# Altium schematic sheet Extension.SchDoc
size A3; PageSetup: Record=PageOptions|CenterHorizontal=True|CenterVertical=True|PrintScale=0.73|XCorrection=1.00|YCorrection=1.00|PrintKind=0|BorderSize=5000000|LeftOffset=0|BottomOffset=0|Orientation=2|PaperLength=1000|PaperWidth=1000|Scale=100|PaperSource=7|PrintQuality=-4|MediaType=1|DitherType=10|PaperKind=A4|PrintScaleMode=1; Date: 27.05.2014; DrawnBy: luths8; Organization: BFH; Address1: Bern University of Applied Sciences; Address2: Engineering and Information Technology; Address3: Jlcoweg 1; Address4: CH-3400 Burgdorf; DocumentNumber: 15; Revision: 1.0; SheetNumber: 18; SheetTotal: 19; CurrentDate: 27.05.2014
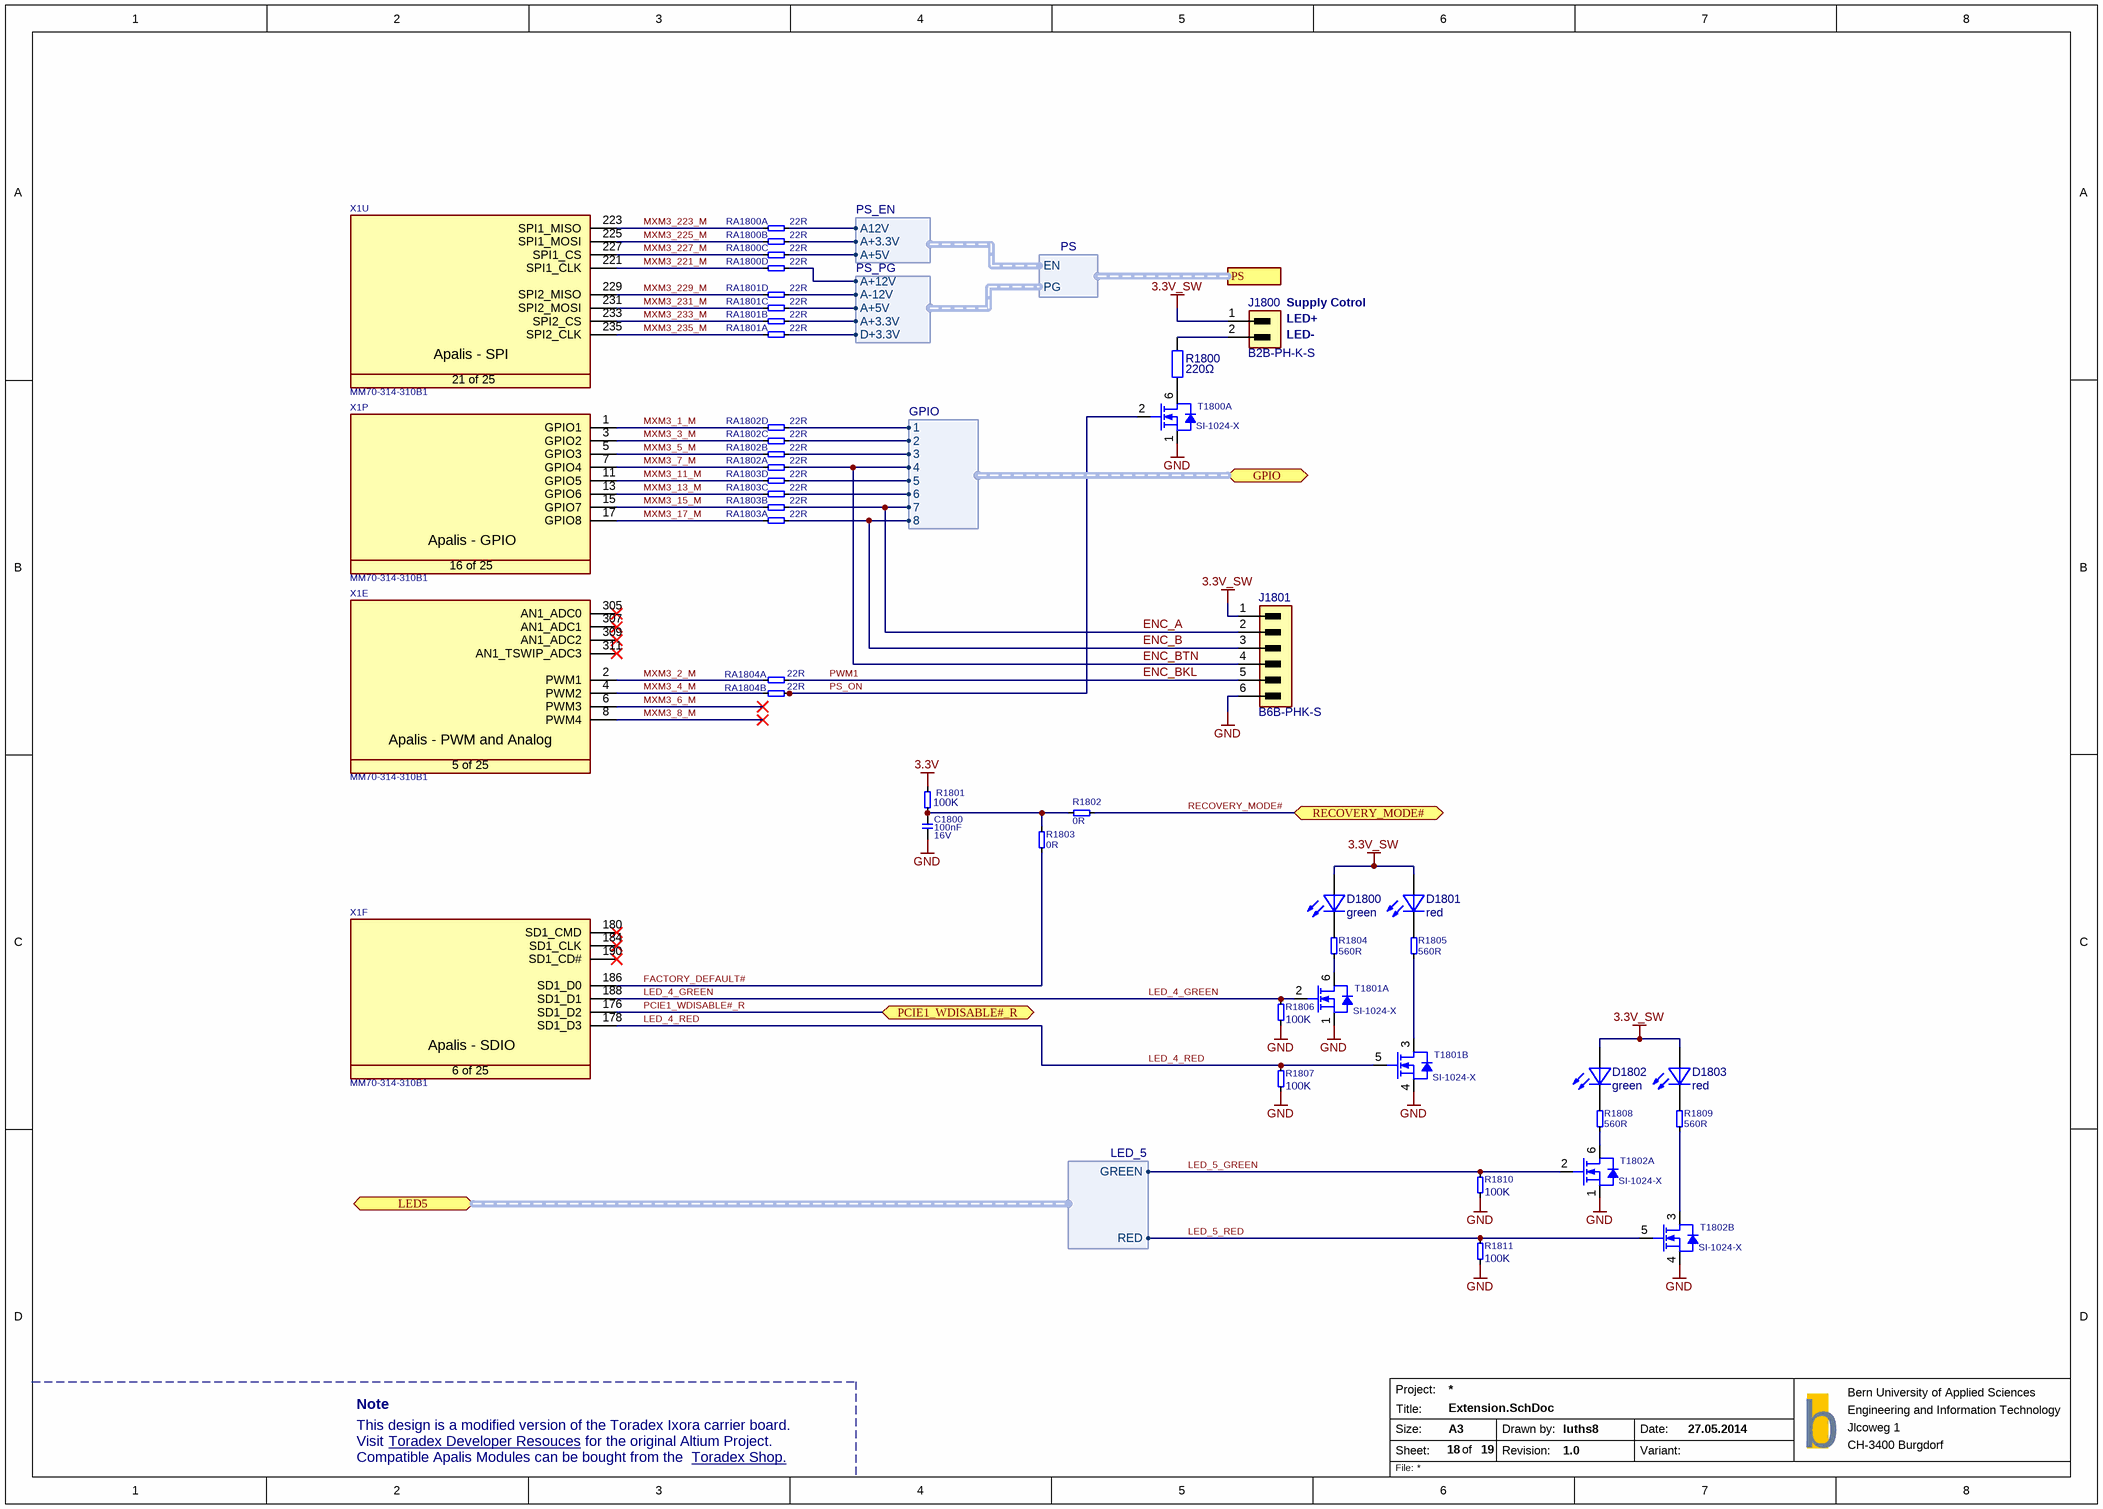
[diagram p0: Extension.SchDoc]

## Parts
C1800  Rating: 16V  [SMD0603CAP]  (hidden comment: 100nF)
D1800  green  [LED]
D1801  red  [LED]
D1802  green  [LED]
D1803  red  [LED]
J1800  B2B-PH-K-S  [B2B-PH-K-S]
J1801  B6B-PHK-S  [B6B-PH-K-S]
R1800  220Ω  [SMD0603RES]
R1801  100K  [SMD0603RES]
R1802  0R  [SMD0603RES]
R1803  0R  [SMD0603RES]
R1804  560R  [SMD0603RES]
R1805  560R  [SMD0603RES]
R1806  100K  [SMD0603RES]
R1807  100K  [SMD0603RES]
R1808  560R  [SMD0603RES]
R1809  560R  [SMD0603RES]
R1810  100K  [SMD0603RES]
R1811  100K  [SMD0603RES]
RA1800  22R  [T_Resistor_Array_X4]  (parts A,B,C,D of 4)
RA1801  22R  [T_Resistor_Array_X4]  (parts A,B,C,D of 4)
RA1802  22R  [T_Resistor_Array_X4]  (parts A,B,C,D of 4)
RA1803  22R  [T_Resistor_Array_X4]  (parts A,B,C,D of 4)
RA1804  22R  [T_Resistor_Array_X4]  (parts A,B of 4)
T1800  Manufacturer Part No.: SI-1024-X  [SOTFL50P160X60-6N]  (hidden comment: T-Vishay-SI-1024X-N)  (part A of 2)
T1801  Manufacturer Part No.: SI-1024-X  [SOTFL50P160X60-6N]  (hidden comment: T-Vishay-SI-1024X-N)  (parts A,B of 2)
T1802  Manufacturer Part No.: SI-1024-X  [SOTFL50P160X60-6N]  (hidden comment: T-Vishay-SI-1024X-N)  (parts A,B of 2)
X1  Manufacturer Part No.: MM70-314-310B1  [T_JAE_MM70-314-310B1]  (hidden comment: CON-JAE-MM70-314-310B1-314-0.5mm)  (parts E,F,P,U of 25)

## Ports
GPIO (bidir, harness GPIO, see 11, 12, 4), LED5 (bidir, harness LED_5, see 8), PCIE1_WDISABLE#_R (bidir, see 18), PS (harness PS), RECOVERY_MODE# (bidir, see 11)

## Harnesses
LED_5: GREEN, RED
PS: EN, PG
GPIO: 1, 2, 3, 4, 5, 6, 7, 8
PS_EN: A12V, A+3.3V, A+5V
PS_PG: A+12V, A-12V, A+3.3V, A+5V, D+3.3V

## Nets
3.3V: R1801.1
3.3V_SW: D1800.A D1801.A D1802.A D1803.A J1800.1 J1801.1
GND: C1800.1 J1801.6 R1806.2 R1807.2 R1810.2 R1811.2 T1800.1(S) T1801.1(S) T1801.4(S) T1802.1(S) T1802.4(S)
ENC_A: J1801.2 RA1803.6 ; port GPIO.7
ENC_B: J1801.3 RA1803.5 ; port GPIO.8
ENC_BKL: J1801.5 RA1804.1  [also labelled PWM1]
ENC_BTN: J1801.4 RA1802.5 ; port GPIO.4
FACTORY_DEFAULT#: R1803.1 X1.186(SD1_D0)
LED_4_GREEN: R1806.1 T1801.2(G) X1.188(SD1_D1)
LED_4_RED: R1807.1 T1801.5(G) X1.178(SD1_D3)
LED_5_GREEN: R1810.1 T1802.2(G) ; port LED5.GREEN
LED_5_RED: R1811.1 T1802.5(G) ; port LED5.RED
MXM3_1_M: RA1802.4 X1.1(GPIO1)
MXM3_2_M: RA1804.5 X1.2(PWM1)
MXM3_3_M: RA1802.3 X1.3(GPIO2)
MXM3_4_M: RA1804.6 X1.4(PWM2)
MXM3_5_M: RA1802.2 X1.5(GPIO3)
MXM3_6_M: X1.6(PWM3)
MXM3_7_M: RA1802.1 X1.7(GPIO4)
MXM3_8_M: X1.8(PWM4)
MXM3_11_M: RA1803.4 X1.11(GPIO5)
MXM3_13_M: RA1803.3 X1.13(GPIO6)
MXM3_15_M: RA1803.2 X1.15(GPIO7)
MXM3_17_M: RA1803.1 X1.17(GPIO8)
MXM3_221_M: RA1800.4 X1.221(SPI1_CLK)
MXM3_223_M: RA1800.1 X1.223(SPI1_MISO)
MXM3_225_M: RA1800.2 X1.225(SPI1_MOSI)
MXM3_227_M: RA1800.3 X1.227(SPI1_CS)
MXM3_229_M: RA1801.4 X1.229(SPI2_MISO)
MXM3_231_M: RA1801.3 X1.231(SPI2_MOSI)
MXM3_233_M: RA1801.2 X1.233(SPI2_CS)
MXM3_235_M: RA1801.1 X1.235(SPI2_CLK)
PCIE1_WDISABLE#_R: X1.176(SD1_D2) ; port PCIE1_WDISABLE#_R
PS_ON: RA1804.2 T1800.2(G)
RECOVERY_MODE#: R1802.2 ; port RECOVERY_MODE#
NetC1800_2: C1800.2 R1801.2 R1802.1 R1803.2
NetD1800_C: D1800.C R1804.2
NetD1801_C: D1801.C R1805.2
NetD1802_C: D1802.C R1808.1
NetD1803_C: D1803.C R1809.1
NetJ1800_2: J1800.2 R1800.2
NetR1800_1: R1800.1 T1800.6(D)
NetR1804_1: R1804.1 T1801.6(D)
NetR1805_1: R1805.1 T1801.3(D)
NetR1808_2: R1808.2 T1802.6(D)
NetR1809_2: R1809.2 T1802.3(D)
NetRA1800_5: RA1800.5 ; harness PS_EN.A12V
NetRA1800_6: RA1800.6 ; harness PS_EN.A+3.3V
NetRA1800_7: RA1800.7 ; harness PS_EN.A+5V
NetRA1800_8: RA1800.8 ; harness PS_PG.A+12V
NetRA1801_5: RA1801.5 ; harness PS_PG.D+3.3V
NetRA1801_6: RA1801.6 ; harness PS_PG.A+3.3V
NetRA1801_7: RA1801.7 ; harness PS_PG.A+5V
NetRA1801_8: RA1801.8 ; harness PS_PG.A-12V
NetRA1802_6: RA1802.6 ; port GPIO.3
NetRA1802_7: RA1802.7 ; port GPIO.2
NetRA1802_8: RA1802.8 ; port GPIO.1
NetRA1803_7: RA1803.7 ; port GPIO.6
NetRA1803_8: RA1803.8 ; port GPIO.5

Not connected (* = marked no-connect by the designer): X1 180(SD1_CMD)* 184(SD1_CLK)* 190(SD1_CD#)* 305(AN1_ADC0)* 307(AN1_ADC1)* 309(AN1_ADC2)* 311(AN1_TSWIP_ADC3)*

## Notes on the sheet
- (near J1800) Supply Cotrol
- (near J1800) LED+
- (near J1800) LED-
- Note
- This design is a modified version of the Toradex Ixora carrier board.
- Visit
- Compatible Apalis Modules can be bought from the
- Toradex Developer Resouces <https://developer.toradex.com/products/ixora-carrier-board>
- for the original Altium Project.
- Toradex Shop. <https://www.toradex.com/order-now/apalis-arm-family>
- Project:
- Size:
- Sheet:
- Title:
- A3
- of
- Drawn by:
- Revision:
- Date:
- Variant:
- b
- File:
- (in symbol CON-JAE-MM70-314-310B1-314-0.5mm, part E) Apalis - PWM and Analog; 5 of 25
- (in symbol CON-JAE-MM70-314-310B1-314-0.5mm, part F) Apalis - SDIO; 6 of 25
- (in symbol CON-JAE-MM70-314-310B1-314-0.5mm, part P) Apalis - GPIO; 16 of 25
- (in symbol CON-JAE-MM70-314-310B1-314-0.5mm, part U) Apalis - SPI; 21 of 25

## Library data of the parts
C1800 = C-X7R-100nF-16V-10%-0402: Capacitor Ceramic X7R 100nF 16V 10% 0603; Tolerance: 10%; Type: X7R; Value: 100nF
D1800 D1802 = LED green: Manufacturer Part No.: LGM67KG1J224Z
D1801 D1803 = LED red: Manufacturer Part No.: LS M67K-J2L1-1-Z
J1800 = Connector 2x1P: Manufacturer Part No.: B2B-PH-K-S; System: Connector
J1801 = Connector 6x1P: Manufacturer Part No.: B6B-PHK-S; System: Connector
R1800 = Resistor
R1801 R1806 R1807 R1810 R1811 = R-100KR-63mW-5%-0402: Resistor 100 Kohm 63mW 5% 0603; Value: 100KR; Rating: 63mW; Tolerance: 5%
R1802 R1803 = R-0R-63mW-1%-0603: Resistor 0 ohm 63mW 1% 0603; Rating: 63mW; Tolerance: 1%; Value: 0R
R1804 R1805 R1808 R1809 = R-560R-63mW-5%-0402: Resistor 560 ohm 63mW 5% 0603; Rating: 63mW; Tolerance: 5%; Value: 560R
RA1800-RA1804 = RA-22R-63mW-5%-1206-div: Resistor Array 22 R 63mW 5% 1206; Tolerance: 5%; Power Dissipation: 63mW; Value: 22R
T1800-T1802 = T-Vishay-SI-1024X-N: Dual N-Channel 20V (D-S)  MOSFET; Manufacturer Name: Vishay
X1 = CON-JAE-MM70-314-310B1-314-0.5mm: MXM3 Connector; Manufacturer Name: JAE; No. of ways: 314